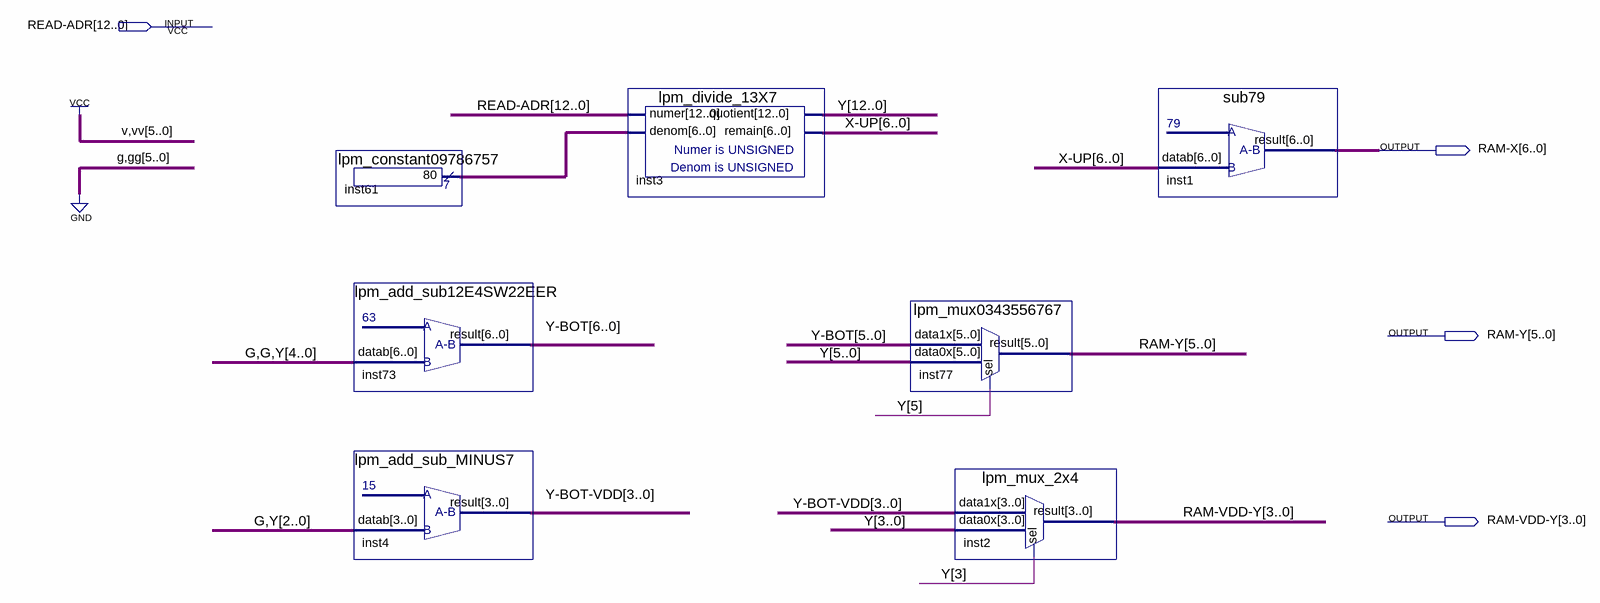
[diagram p0: schematic sheet]
// Quartus schematic ADR-cal-ram.bdf as structural Verilog: 7 symbols, 4 pins
module \ADR-cal-ram  (
  input  [12:0] \READ-ADR ,
  output [6:0] \RAM-X ,
  output [5:0] \RAM-Y ,
  output [3:0] \RAM-VDD-Y 
);

  wire [3:0] \Y-BOT-VDD ;
  wire [6:0] inst61_result, \X-UP , \Y-BOT ;
  wire [12:0] Y;

  lpm_constant09786757 inst61 (.result(inst61_result));
  lpm_add_sub12E4SW22EER inst73 (.datab({2'b00, Y[4:0]}), .result(\Y-BOT ));
  lpm_add_sub_MINUS7 inst4 (.datab({1'b0, Y[2:0]}), .result(\Y-BOT-VDD ));
  lpm_divide_13X7 inst3 (.numer(\READ-ADR ), .denom(inst61_result), .quotient(Y), .remain(\X-UP ));
  lpm_mux0343556767 inst77 (.data1x(\Y-BOT [5:0]), .data0x(Y[5:0]), .sel(Y[5]), .result(\RAM-Y ));
  lpm_mux_2x4 inst2 (.data1x(\Y-BOT-VDD ), .data0x(Y[3:0]), .sel(Y[3]), .result(\RAM-VDD-Y ));
  sub79 inst1 (.datab(\X-UP ), .result(\RAM-X ));
endmodule
